# Altium project PCB_3U_Kasli.PrjPCB (part 7 of 7)
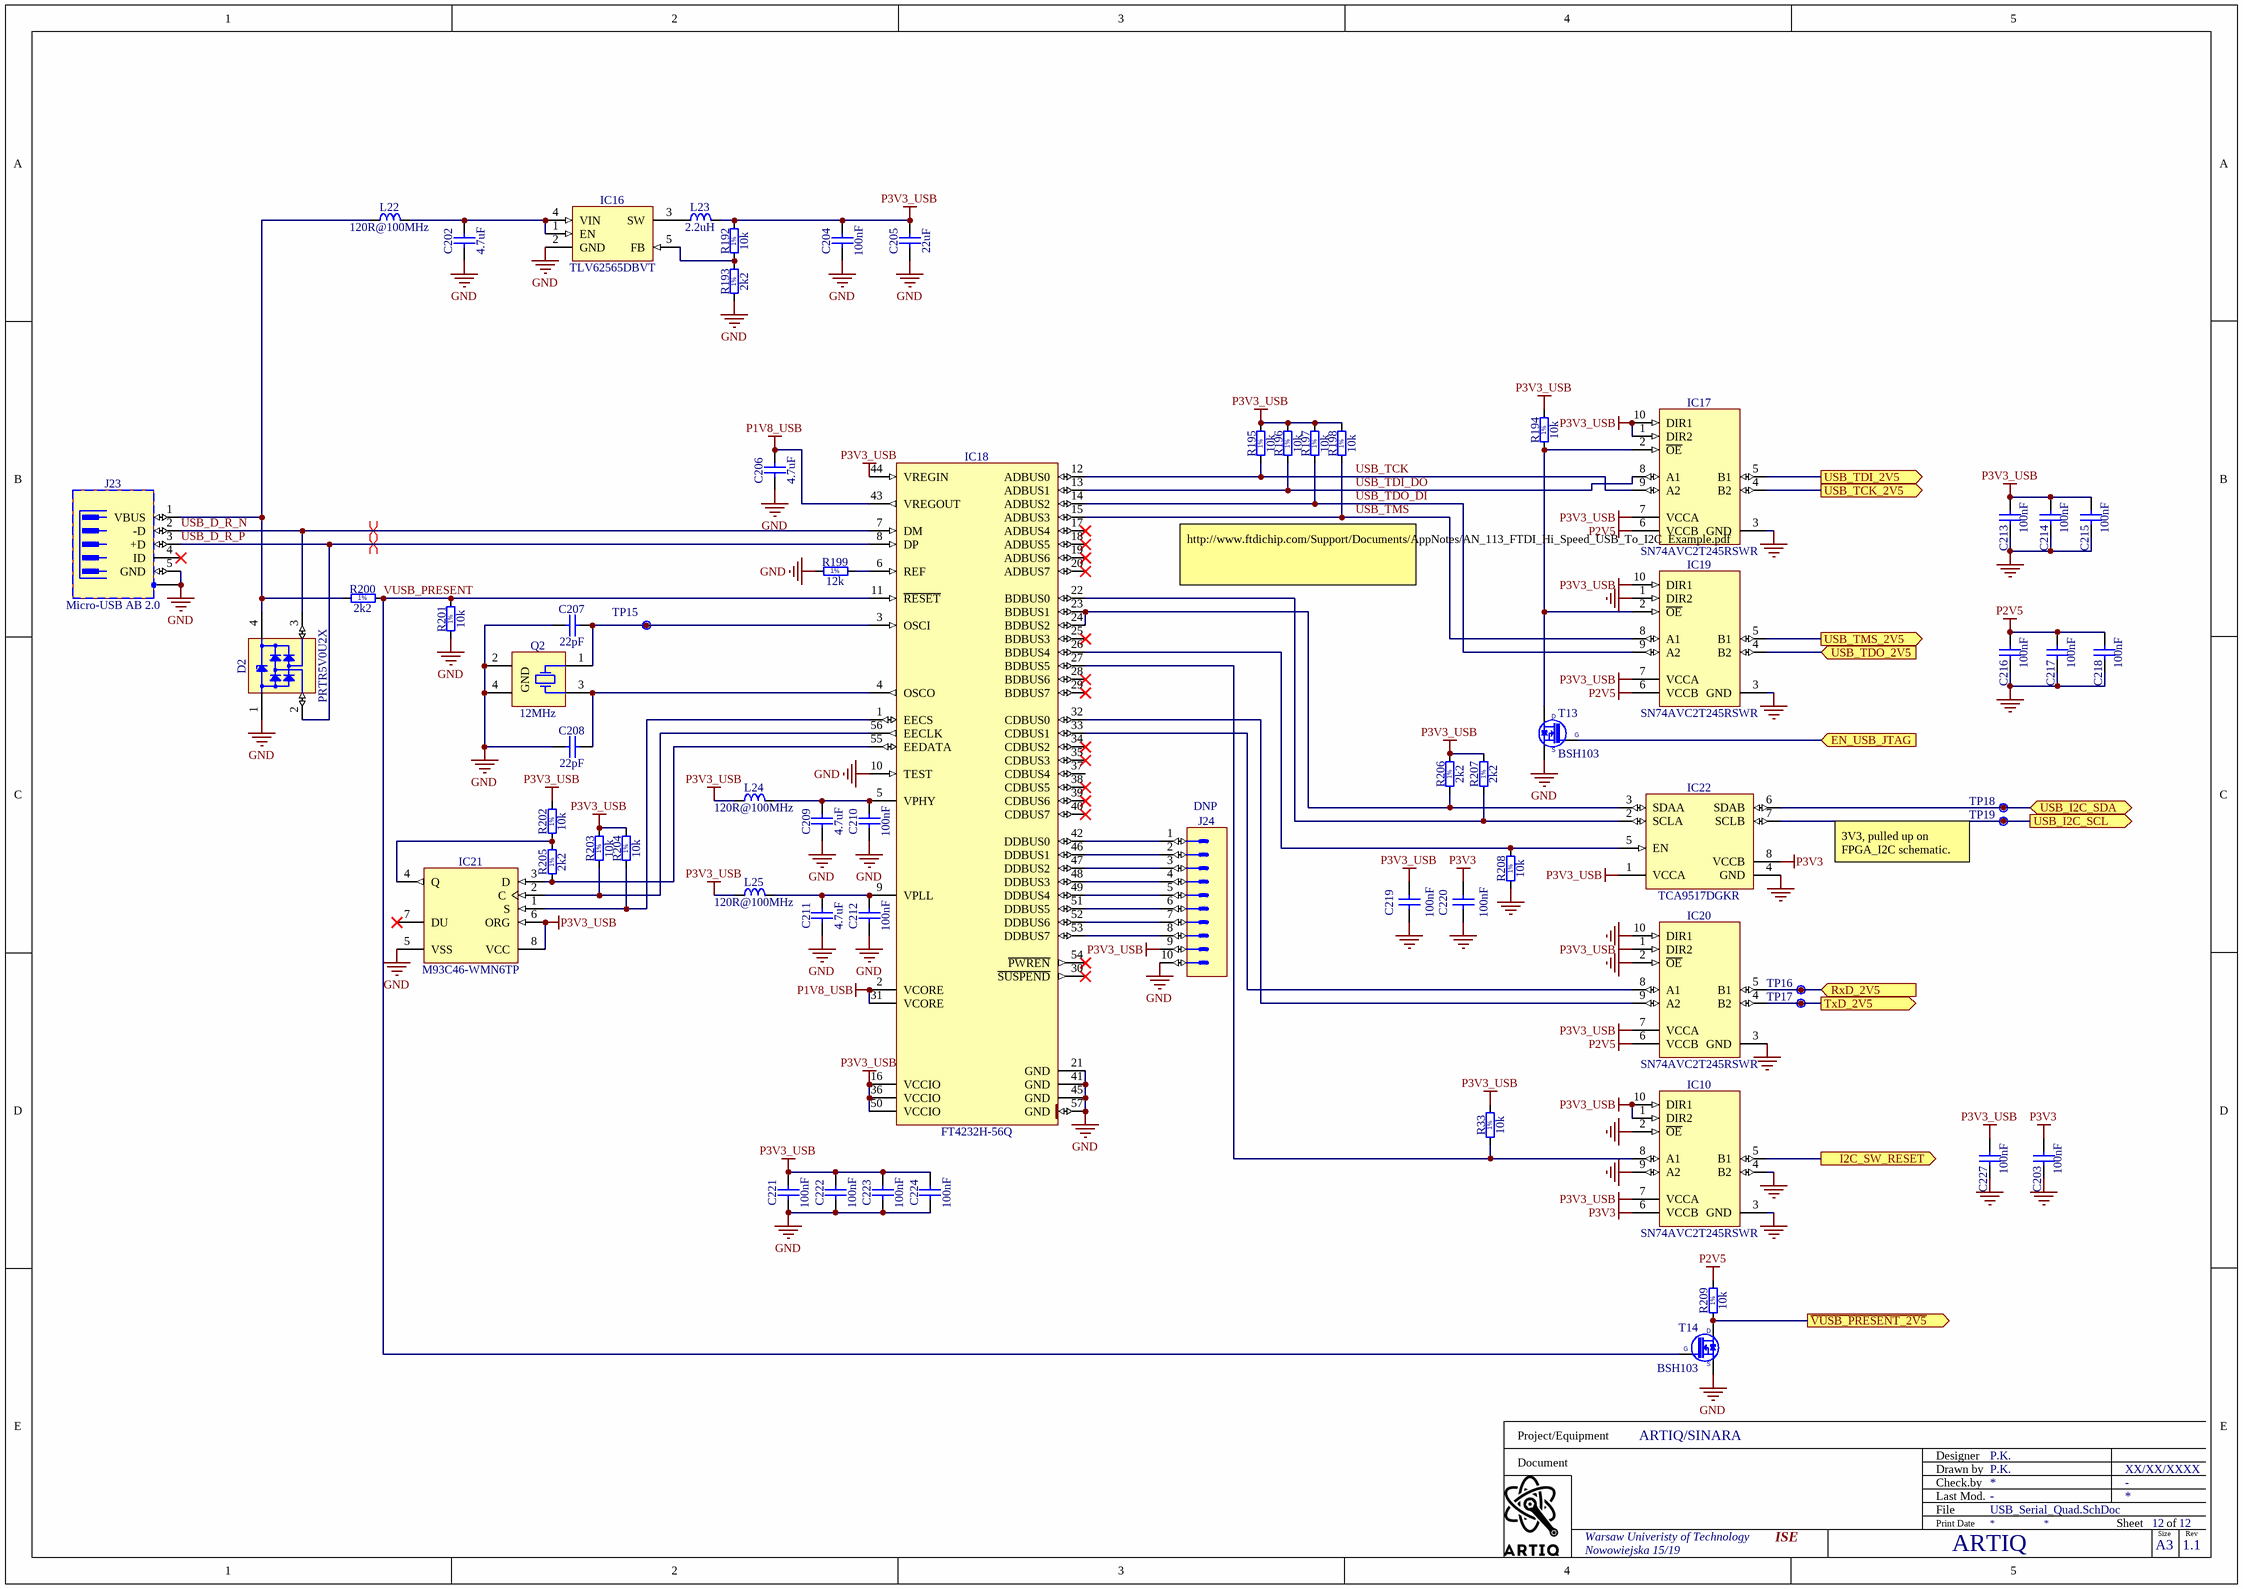
[diagram p111: USB_Serial_Quad.SchDoc]

## Nets that join several sheets
GND: TOP (6 pins), FPGA (7 pins), ClockRecovery (63 pins), PowerSupplies (110 pins), U_SFP_0 (35 pins), U_SFP_1 (35 pins), U_SFP_2 (35 pins), BackplaneConnector (25 pins), FPGAPower&Misc (176 pins), FPGAGTP (5 pins), FPGA_I2C (15 pins), FPGA_SDRAM (46 pins), IDC_EXT_Connectors (88 pins), USB_Serial_Quad (54 pins)
MGTAVCC: PowerSupplies (C148.2 L15.2), FPGAPower&Misc (10 pins)
MGTAVTT: PowerSupplies (L18.2 L19.2), FPGAPower&Misc (13 pins), FPGAGTP (R191.1)
P1V0: PowerSupplies (7 pins), FPGAPower&Misc (29 pins)
P1V5: PowerSupplies (L17.2 R61.1 T9.1 TP10.1), FPGAPower&Misc (14 pins), FPGA_SDRAM (29 pins)
P1V8: PowerSupplies (7 pins), FPGAPower&Misc (L4.1)
P2V5: TOP (5 pins), FPGA (R42.2), ClockRecovery (R1.1 R210.1), PowerSupplies (10 pins), U_SFP_0 (6 pins), U_SFP_1 (6 pins), U_SFP_2 (6 pins), FPGAPower&Misc (64 pins), FPGAGTP (C238.2 OSC2.2 OSC2.6), FPGA_I2C (5 pins), USB_Serial_Quad (7 pins)
P3V3: TOP (C161.2 U2.2), FPGA (R11.2 R20.2 R44.2), ClockRecovery (C28.2 IC7.8 L3.1), PowerSupplies (10 pins), U_SFP_0 (17 pins), U_SFP_1 (17 pins), U_SFP_2 (17 pins), BackplaneConnector (9 pins), FPGAPower&Misc (R55.2), FPGA_I2C (43 pins), FPGA_SDRAM (C172.2 IC9.7 IC9.10 R127.2), IDC_EXT_Connectors (18 pins), USB_Serial_Quad (C203.2 C220.2 IC10.6 IC22.8)
P12V0: PowerSupplies (20 pins), BackplaneConnector (6 pins), IDC_EXT_Connectors (16 pins)
VCCAUX: PowerSupplies (C233.2 L26.2), FPGAPower&Misc (13 pins)
VCCBRAM: PowerSupplies (C149.2 L13.2), FPGAPower&Misc (8 pins)
~{VUSB_PRESENT_2V5}: FPGA (IC4.N13), USB_Serial_Quad (R209.1 T14.3)
CFG_CCLK: TOP (U2.16), FPGAPower&Misc (IC4.L12)
CFG_D02: TOP (R96.1 U2.9), FPGA (IC4.P21)
CFG_D03: TOP (R94.1 U2.1), FPGA (IC4.R21)
CFG_DIN: TOP (U2.8), FPGA (IC4.R22)
CFG_FCS: TOP (R95.1 U2.7), FPGA (IC4.T19)
CFG_MOSI: TOP (U2.15), FPGA (IC4.P22)
CFG_TCK: FPGAPower&Misc (IC4.V12 J8.6), USB_Serial_Quad (IC17.4)
CFG_TDI: FPGAPower&Misc (IC4.R13 J8.10), USB_Serial_Quad (IC17.5)
CFG_TDO: FPGAPower&Misc (IC4.U13 J8.8), USB_Serial_Quad (IC19.4)
CFG_TMS: FPGAPower&Misc (IC4.T13 J8.4), USB_Serial_Quad (IC19.5)
CK_FPGAIO_N: FPGA (IC4.Y19), ClockRecovery (C6.2 R210.2 R211.2)
CK_FPGAIO_P: FPGA (IC4.Y18), ClockRecovery (C4.2 R1.2 R2.2)
CK_GTP_N: ClockRecovery (C11.2), FPGAGTP (IC4.E6)
CK_GTP_P: ClockRecovery (C8.2), FPGAGTP (IC4.F6)
CLK_EXT_N: ClockRecovery (C45.2), BackplaneConnector (J20.b3)
CLK_EXT_P: ClockRecovery (C38.2), BackplaneConnector (J20.c3)
CLKREC_N: FPGA (IC4.V20), ClockRecovery (C2.1 R3.1)
CLKREC_P: FPGA (IC4.U20), ClockRecovery (C1.1 R3.2)
EXT0.LVDS_0_N: FPGA (IC4.T4), IDC_EXT_Connectors (J9.3)
EXT0.LVDS_0_P: FPGA (IC4.R4), IDC_EXT_Connectors (J9.2)
EXT0.LVDS_1_N: FPGA (IC4.R2), IDC_EXT_Connectors (J9.6)
EXT0.LVDS_1_P: FPGA (IC4.R3), IDC_EXT_Connectors (J9.5)
EXT0.LVDS_2_N: FPGA (IC4.U1), IDC_EXT_Connectors (J9.9)
EXT0.LVDS_2_P: FPGA (IC4.T1), IDC_EXT_Connectors (J9.8)
EXT0.LVDS_3_N: FPGA (IC4.V2), IDC_EXT_Connectors (J9.12)
EXT0.LVDS_3_P: FPGA (IC4.U2), IDC_EXT_Connectors (J9.11)
EXT0.LVDS_4_N: FPGA (IC4.Y1), IDC_EXT_Connectors (J9.15)
EXT0.LVDS_4_P: FPGA (IC4.W1), IDC_EXT_Connectors (J9.14)
EXT0.LVDS_5_N: FPGA (IC4.Y2), IDC_EXT_Connectors (J9.18)
EXT0.LVDS_5_P: FPGA (IC4.W2), IDC_EXT_Connectors (J9.17)
EXT0.LVDS_6_N: FPGA (IC4.AB1), IDC_EXT_Connectors (J9.21)
EXT0.LVDS_6_P: FPGA (IC4.AA1), IDC_EXT_Connectors (J9.20)
EXT0.LVDS_7_N: FPGA (IC4.AA4), IDC_EXT_Connectors (J9.24)
EXT0.LVDS_7_P: FPGA (IC4.Y4), IDC_EXT_Connectors (J9.23)
EXT1.LVDS_0_N: FPGA (IC4.U5), IDC_EXT_Connectors (J10.3)
EXT1.LVDS_0_P: FPGA (IC4.T5), IDC_EXT_Connectors (J10.2)
EXT1.LVDS_1_N: FPGA (IC4.W7), IDC_EXT_Connectors (J10.6)
EXT1.LVDS_1_P: FPGA (IC4.V7), IDC_EXT_Connectors (J10.5)
EXT1.LVDS_2_N: FPGA (IC4.V3), IDC_EXT_Connectors (J10.9)
EXT1.LVDS_2_P: FPGA (IC4.U3), IDC_EXT_Connectors (J10.8)
EXT1.LVDS_3_N: FPGA (IC4.V8), IDC_EXT_Connectors (J10.12)
EXT1.LVDS_3_P: FPGA (IC4.V9), IDC_EXT_Connectors (J10.11)
EXT1.LVDS_4_N: FPGA (IC4.AB2), IDC_EXT_Connectors (J10.15)
EXT1.LVDS_4_P: FPGA (IC4.AB3), IDC_EXT_Connectors (J10.14)
EXT1.LVDS_5_N: FPGA (IC4.T6), IDC_EXT_Connectors (J10.18)
EXT1.LVDS_5_P: FPGA (IC4.R6), IDC_EXT_Connectors (J10.17)
EXT1.LVDS_6_N: FPGA (IC4.V5), IDC_EXT_Connectors (J10.21)
EXT1.LVDS_6_P: FPGA (IC4.U6), IDC_EXT_Connectors (J10.20)
EXT1.LVDS_7_N: FPGA (IC4.AB5), IDC_EXT_Connectors (J10.24)
EXT1.LVDS_7_P: FPGA (IC4.AA5), IDC_EXT_Connectors (J10.23)
EXT2.LVDS_0_N: FPGA (IC4.W4), IDC_EXT_Connectors (J11.3)
EXT2.LVDS_0_P: FPGA (IC4.V4), IDC_EXT_Connectors (J11.2)
EXT2.LVDS_1_N: FPGA (IC4.AA3), IDC_EXT_Connectors (J11.6)
EXT2.LVDS_1_P: FPGA (IC4.Y3), IDC_EXT_Connectors (J11.5)
EXT2.LVDS_2_N: FPGA (IC4.W5), IDC_EXT_Connectors (J11.9)
EXT2.LVDS_2_P: FPGA (IC4.W6), IDC_EXT_Connectors (J11.8)
EXT2.LVDS_3_N: FPGA (IC4.Y7), IDC_EXT_Connectors (J11.12)
EXT2.LVDS_3_P: FPGA (IC4.Y8), IDC_EXT_Connectors (J11.11)
EXT2.LVDS_4_N: FPGA (IC4.AA6), IDC_EXT_Connectors (J11.15)
EXT2.LVDS_4_P: FPGA (IC4.Y6), IDC_EXT_Connectors (J11.14)
EXT2.LVDS_5_N: FPGA (IC4.AB6), IDC_EXT_Connectors (J11.18)
EXT2.LVDS_5_P: FPGA (IC4.AB7), IDC_EXT_Connectors (J11.17)
EXT2.LVDS_6_N: FPGA (IC4.AB8), IDC_EXT_Connectors (J11.21)
EXT2.LVDS_6_P: FPGA (IC4.AA8), IDC_EXT_Connectors (J11.20)
EXT2.LVDS_7_N: FPGA (IC4.Y9), IDC_EXT_Connectors (J11.24)
EXT2.LVDS_7_P: FPGA (IC4.W9), IDC_EXT_Connectors (J11.23)
EXT3.LVDS_0_N: FPGA (IC4.L20), IDC_EXT_Connectors (J12.3)
EXT3.LVDS_0_P: FPGA (IC4.L19), IDC_EXT_Connectors (J12.2)
EXT3.LVDS_1_N: FPGA (IC4.L13), IDC_EXT_Connectors (J12.6)
EXT3.LVDS_1_P: FPGA (IC4.M13), IDC_EXT_Connectors (J12.5)
EXT3.LVDS_2_N: FPGA (IC4.M20), IDC_EXT_Connectors (J12.9)
EXT3.LVDS_2_P: FPGA (IC4.N20), IDC_EXT_Connectors (J12.8)
EXT3.LVDS_3_N: FPGA (IC4.K14), IDC_EXT_Connectors (J12.12)
EXT3.LVDS_3_P: FPGA (IC4.K13), IDC_EXT_Connectors (J12.11)
EXT3.LVDS_4_N: FPGA (IC4.L15), IDC_EXT_Connectors (J12.15)
EXT3.LVDS_4_P: FPGA (IC4.L14), IDC_EXT_Connectors (J12.14)
EXT3.LVDS_5_N: FPGA (IC4.M16), IDC_EXT_Connectors (J12.18)
EXT3.LVDS_5_P: FPGA (IC4.M15), IDC_EXT_Connectors (J12.17)
EXT3.LVDS_6_N: FPGA (IC4.L18), IDC_EXT_Connectors (J12.21)
EXT3.LVDS_6_P: FPGA (IC4.M18), IDC_EXT_Connectors (J12.20)
EXT3.LVDS_7_N: FPGA (IC4.N19), IDC_EXT_Connectors (J12.24)
EXT3.LVDS_7_P: FPGA (IC4.N18), IDC_EXT_Connectors (J12.23)
EXT4.LVDS_0_N: FPGA (IC4.V19), IDC_EXT_Connectors (J13.3)
EXT4.LVDS_0_P: FPGA (IC4.V18), IDC_EXT_Connectors (J13.2)
EXT4.LVDS_1_N: FPGA (IC4.Y22), IDC_EXT_Connectors (J13.6)
EXT4.LVDS_1_P: FPGA (IC4.Y21), IDC_EXT_Connectors (J13.5)
EXT4.LVDS_2_N: FPGA (IC4.W17), IDC_EXT_Connectors (J13.9)
EXT4.LVDS_2_P: FPGA (IC4.V17), IDC_EXT_Connectors (J13.8)
EXT4.LVDS_3_N: FPGA (IC4.W22), IDC_EXT_Connectors (J13.12)
EXT4.LVDS_3_P: FPGA (IC4.W21), IDC_EXT_Connectors (J13.11)
EXT4.LVDS_4_N: FPGA (IC4.AB18), IDC_EXT_Connectors (J13.15)
EXT4.LVDS_4_P: FPGA (IC4.AA18), IDC_EXT_Connectors (J13.14)
EXT4.LVDS_5_N: FPGA (IC4.AB20), IDC_EXT_Connectors (J13.18)
EXT4.LVDS_5_P: FPGA (IC4.AA19), IDC_EXT_Connectors (J13.17)
EXT4.LVDS_6_N: FPGA (IC4.AA21), IDC_EXT_Connectors (J13.21)
EXT4.LVDS_6_P: FPGA (IC4.AA20), IDC_EXT_Connectors (J13.20)
EXT4.LVDS_7_N: FPGA (IC4.AB22), IDC_EXT_Connectors (J13.24)
EXT4.LVDS_7_P: FPGA (IC4.AB21), IDC_EXT_Connectors (J13.23)
EXT5.LVDS_0_N: FPGA (IC4.K19), IDC_EXT_Connectors (J14.3)
EXT5.LVDS_0_P: FPGA (IC4.K18), IDC_EXT_Connectors (J14.2)
EXT5.LVDS_1_N: FPGA (IC4.H15), IDC_EXT_Connectors (J14.6)
EXT5.LVDS_1_P: FPGA (IC4.J15), IDC_EXT_Connectors (J14.5)
EXT5.LVDS_2_N: FPGA (IC4.K22), IDC_EXT_Connectors (J14.9)
EXT5.LVDS_2_P: FPGA (IC4.K21), IDC_EXT_Connectors (J14.8)
EXT5.LVDS_3_N: FPGA (IC4.M22), IDC_EXT_Connectors (J14.12)
EXT5.LVDS_3_P: FPGA (IC4.N22), IDC_EXT_Connectors (J14.11)
EXT5.LVDS_4_N: FPGA (IC4.G18), IDC_EXT_Connectors (J14.15)
EXT5.LVDS_4_P: FPGA (IC4.G17), IDC_EXT_Connectors (J14.14)
EXT5.LVDS_5_N: FPGA (IC4.J21), IDC_EXT_Connectors (J14.18)
EXT5.LVDS_5_P: FPGA (IC4.J20), IDC_EXT_Connectors (J14.17)
EXT5.LVDS_6_N: FPGA (IC4.L21), IDC_EXT_Connectors (J14.21)
EXT5.LVDS_6_P: FPGA (IC4.M21), IDC_EXT_Connectors (J14.20)
EXT5.LVDS_7_N: FPGA (IC4.K16), IDC_EXT_Connectors (J14.24)
EXT5.LVDS_7_P: FPGA (IC4.L16), IDC_EXT_Connectors (J14.23)
EXT6.LVDS_0_N: FPGA (IC4.H19), IDC_EXT_Connectors (J15.3)
EXT6.LVDS_0_P: FPGA (IC4.J19), IDC_EXT_Connectors (J15.2)
EXT6.LVDS_1_N: FPGA (IC4.H18), IDC_EXT_Connectors (J15.6)
EXT6.LVDS_1_P: FPGA (IC4.H17), IDC_EXT_Connectors (J15.5)
EXT6.LVDS_2_N: FPGA (IC4.G20), IDC_EXT_Connectors (J15.9)
EXT6.LVDS_2_P: FPGA (IC4.H20), IDC_EXT_Connectors (J15.8)
EXT6.LVDS_3_N: FPGA (IC4.J17), IDC_EXT_Connectors (J15.12)
EXT6.LVDS_3_P: FPGA (IC4.K17), IDC_EXT_Connectors (J15.11)
EXT6.LVDS_4_N: FPGA (IC4.H14), IDC_EXT_Connectors (J15.15)
EXT6.LVDS_4_P: FPGA (IC4.J14), IDC_EXT_Connectors (J15.14)
EXT6.LVDS_5_N: FPGA (IC4.H22), IDC_EXT_Connectors (J15.18)
EXT6.LVDS_5_P: FPGA (IC4.J22), IDC_EXT_Connectors (J15.17)
EXT6.LVDS_6_N: FPGA (IC4.G13), IDC_EXT_Connectors (J15.21)
EXT6.LVDS_6_P: FPGA (IC4.H13), IDC_EXT_Connectors (J15.20)
EXT6.LVDS_7_N: FPGA (IC4.G16), IDC_EXT_Connectors (J15.24)
EXT6.LVDS_7_P: FPGA (IC4.G15), IDC_EXT_Connectors (J15.23)
EXT7.LVDS_0_N: FPGA (IC4.D19), IDC_EXT_Connectors (J16.3)
EXT7.LVDS_0_P: FPGA (IC4.E19), IDC_EXT_Connectors (J16.2)
EXT7.LVDS_1_N: FPGA (IC4.G22), IDC_EXT_Connectors (J16.6)
EXT7.LVDS_1_P: FPGA (IC4.G21), IDC_EXT_Connectors (J16.5)
EXT7.LVDS_2_N: FPGA (IC4.F20), IDC_EXT_Connectors (J16.9)
EXT7.LVDS_2_P: FPGA (IC4.F19), IDC_EXT_Connectors (J16.8)
EXT7.LVDS_3_N: FPGA (IC4.F14), IDC_EXT_Connectors (J16.12)
EXT7.LVDS_3_P: FPGA (IC4.F13), IDC_EXT_Connectors (J16.11)
EXT7.LVDS_4_N: FPGA (IC4.E14), IDC_EXT_Connectors (J16.15)
EXT7.LVDS_4_P: FPGA (IC4.E13), IDC_EXT_Connectors (J16.14)
EXT7.LVDS_5_N: FPGA (IC4.D15), IDC_EXT_Connectors (J16.18)
EXT7.LVDS_5_P: FPGA (IC4.D14), IDC_EXT_Connectors (J16.17)
EXT7.LVDS_6_N: FPGA (IC4.E18), IDC_EXT_Connectors (J16.21)
EXT7.LVDS_6_P: FPGA (IC4.F18), IDC_EXT_Connectors (J16.20)
EXT7.LVDS_7_N: FPGA (IC4.E17), IDC_EXT_Connectors (J16.24)
EXT7.LVDS_7_P: FPGA (IC4.F16), IDC_EXT_Connectors (J16.23)
EXT8.LVDS_0_N: FPGA (IC4.C17), BackplaneConnector (J20.a6)
EXT8.LVDS_0_P: FPGA (IC4.D17), BackplaneConnector (J20.a5)
EXT8.LVDS_1_N: FPGA (IC4.A16), BackplaneConnector (J20.b6)
EXT8.LVDS_1_P: FPGA (IC4.A15), BackplaneConnector (J20.b5)
EXT8.LVDS_2_N: FPGA (IC4.A14), BackplaneConnector (J20.c6)
EXT8.LVDS_2_P: FPGA (IC4.A13), BackplaneConnector (J20.c5)
EXT8.LVDS_3_N: FPGA (IC4.A19), BackplaneConnector (J20.a8)
EXT8.LVDS_3_P: FPGA (IC4.A18), BackplaneConnector (J20.a7)
EXT8.LVDS_4_N: FPGA (IC4.B13), BackplaneConnector (J20.b8)
EXT8.LVDS_4_P: FPGA (IC4.C13), BackplaneConnector (J20.b7)
EXT8.LVDS_5_N: FPGA (IC4.C15), BackplaneConnector (J20.c8)
EXT8.LVDS_5_P: FPGA (IC4.C14), BackplaneConnector (J20.c7)
EXT8.LVDS_6_N: FPGA (IC4.A20), BackplaneConnector (J20.a10)
EXT8.LVDS_6_P: FPGA (IC4.B20), BackplaneConnector (J20.a9)
EXT8.LVDS_7_N: FPGA (IC4.B16), BackplaneConnector (J20.b10)
EXT8.LVDS_7_P: FPGA (IC4.B15), BackplaneConnector (J20.b9)
EXT9.LVDS_0_N: FPGA (IC4.C19), BackplaneConnector (J20.a13)
EXT9.LVDS_0_P: FPGA (IC4.C18), BackplaneConnector (J20.a12)
EXT9.LVDS_1_N: FPGA (IC4.A21), BackplaneConnector (J20.b13)
EXT9.LVDS_1_P: FPGA (IC4.B21), BackplaneConnector (J20.b12)
EXT9.LVDS_2_N: FPGA (IC4.D16), BackplaneConnector (J20.c13)
EXT9.LVDS_2_P: FPGA (IC4.E16), BackplaneConnector (J20.c12)
EXT9.LVDS_3_N: FPGA (IC4.B18), BackplaneConnector (J20.a15)
EXT9.LVDS_3_P: FPGA (IC4.B17), BackplaneConnector (J20.a14)
EXT9.LVDS_4_N: FPGA (IC4.C20), BackplaneConnector (J20.b15)
EXT9.LVDS_4_P: FPGA (IC4.D20), BackplaneConnector (J20.b14)
EXT9.LVDS_5_N: FPGA (IC4.D22), BackplaneConnector (J20.c15)
EXT9.LVDS_5_P: FPGA (IC4.E22), BackplaneConnector (J20.c14)
EXT9.LVDS_6_N: FPGA (IC4.B22), BackplaneConnector (J20.a17)
EXT9.LVDS_6_P: FPGA (IC4.C22), BackplaneConnector (J20.a16)
EXT9.LVDS_7_N: FPGA (IC4.D21), BackplaneConnector (J20.b17)
EXT9.LVDS_7_P: FPGA (IC4.E21), BackplaneConnector (J20.b16)
EXT10.LVDS_0_N: FPGA (IC4.V14), BackplaneConnector (J20.a20)
EXT10.LVDS_0_P: FPGA (IC4.V13), BackplaneConnector (J20.a19)
EXT10.LVDS_1_N: FPGA (IC4.AA16), BackplaneConnector (J20.b20)
EXT10.LVDS_1_P: FPGA (IC4.Y16), BackplaneConnector (J20.b19)
EXT10.LVDS_2_N: FPGA (IC4.AB17), BackplaneConnector (J20.c20)
EXT10.LVDS_2_P: FPGA (IC4.AB16), BackplaneConnector (J20.c19)
EXT10.LVDS_3_N: FPGA (IC4.AB13), BackplaneConnector (J20.a22)
EXT10.LVDS_3_P: FPGA (IC4.AA13), BackplaneConnector (J20.a21)
EXT10.LVDS_4_N: FPGA (IC4.AA14), BackplaneConnector (J20.b22)
EXT10.LVDS_4_P: FPGA (IC4.Y13), BackplaneConnector (J20.b21)
EXT10.LVDS_5_N: FPGA (IC4.AB15), BackplaneConnector (J20.c22)
EXT10.LVDS_5_P: FPGA (IC4.AA15), BackplaneConnector (J20.c21)
EXT10.LVDS_6_N: FPGA (IC4.W16), BackplaneConnector (J20.a24)
EXT10.LVDS_6_P: FPGA (IC4.W15), BackplaneConnector (J20.a23)
EXT10.LVDS_7_N: FPGA (IC4.T15), BackplaneConnector (J20.b24)
EXT10.LVDS_7_P: FPGA (IC4.T14), BackplaneConnector (J20.b23)
EXT11.LVDS_0_N: FPGA (IC4.W12), BackplaneConnector (J20.a27)
EXT11.LVDS_0_P: FPGA (IC4.W11), BackplaneConnector (J20.a26)
EXT11.LVDS_1_N: FPGA (IC4.V15), BackplaneConnector (J20.b27)
EXT11.LVDS_1_P: FPGA (IC4.U15), BackplaneConnector (J20.b26)
EXT11.LVDS_2_N: FPGA (IC4.Y14), BackplaneConnector (J20.c27)
EXT11.LVDS_2_P: FPGA (IC4.W14), BackplaneConnector (J20.c26)
EXT11.LVDS_3_N: FPGA (IC4.W10), BackplaneConnector (J20.a29)
EXT11.LVDS_3_P: FPGA (IC4.V10), BackplaneConnector (J20.a28)
EXT11.LVDS_4_N: FPGA (IC4.Y12), BackplaneConnector (J20.b29)
EXT11.LVDS_4_P: FPGA (IC4.Y11), BackplaneConnector (J20.b28)
EXT11.LVDS_5_N: FPGA (IC4.AB12), BackplaneConnector (J20.c29)
EXT11.LVDS_5_P: FPGA (IC4.AB11), BackplaneConnector (J20.c28)
EXT11.LVDS_6_N: FPGA (IC4.AA11), BackplaneConnector (J20.a31)
EXT11.LVDS_6_P: FPGA (IC4.AA10), BackplaneConnector (J20.a30)
EXT11.LVDS_7_N: FPGA (IC4.AB10), BackplaneConnector (J20.b31)
EXT11.LVDS_7_P: FPGA (IC4.AA9), BackplaneConnector (J20.b30)
I2C_3V3_SCL: FPGA_I2C (IC13.7 IC14.19 IC15.19 R149.1), USB_Serial_Quad (IC22.7 TP19.1)
I2C_3V3_SDA: FPGA_I2C (IC13.6 IC14.20 IC15.20 R148.1), USB_Serial_Quad (IC22.6 TP18.1)
I2C_SCL_0: FPGA_I2C (IC14.17 R156.1), IDC_EXT_Connectors (D3.3 J9.27)
I2C_SCL_1: FPGA_I2C (IC14.13 R158.1), IDC_EXT_Connectors (D4.3 J10.27)
I2C_SCL_2: FPGA_I2C (IC14.11 R160.1), IDC_EXT_Connectors (D5.3 J11.27)
I2C_SCL_3: FPGA_I2C (IC14.8 R162.1), IDC_EXT_Connectors (D6.3 J12.27)
I2C_SCL_4: FPGA_I2C (IC14.6 R164.1), IDC_EXT_Connectors (D7.3 J13.27)
I2C_SCL_5: FPGA_I2C (IC14.4 R166.1), IDC_EXT_Connectors (D8.3 J14.27)
I2C_SCL_6: FPGA_I2C (IC14.2 R168.1), IDC_EXT_Connectors (D9.3 J15.27)
I2C_SCL_7: FPGA_I2C (IC14.15 R170.1), IDC_EXT_Connectors (D10.3 J16.27)
I2C_SCL_8: BackplaneConnector (D11.3 J20.c10), FPGA_I2C (IC15.11 R172.1)
I2C_SCL_9: BackplaneConnector (D13.3 J20.c17), FPGA_I2C (IC15.13 R175.1)
I2C_SCL_10: BackplaneConnector (D12.3 J20.c24), FPGA_I2C (IC15.17 R178.1)
I2C_SCL_11: BackplaneConnector (D14.3 J20.c31), FPGA_I2C (IC15.15 R182.1)
I2C_SDA_0: FPGA_I2C (IC14.16 R155.1), IDC_EXT_Connectors (D3.2 J9.26)
I2C_SDA_1: FPGA_I2C (IC14.12 R157.1), IDC_EXT_Connectors (D4.2 J10.26)
I2C_SDA_2: FPGA_I2C (IC14.10 R159.1), IDC_EXT_Connectors (D5.2 J11.26)
I2C_SDA_3: FPGA_I2C (IC14.7 R161.1), IDC_EXT_Connectors (D6.2 J12.26)
I2C_SDA_4: FPGA_I2C (IC14.5 R163.1), IDC_EXT_Connectors (D7.2 J13.26)
I2C_SDA_5: FPGA_I2C (IC14.3 R165.1), IDC_EXT_Connectors (D8.2 J14.26)
I2C_SDA_6: FPGA_I2C (IC14.1 R167.1), IDC_EXT_Connectors (D9.2 J15.26)
I2C_SDA_7: FPGA_I2C (IC14.14 R169.1), IDC_EXT_Connectors (D10.2 J16.26)
I2C_SDA_8: BackplaneConnector (D11.2 J20.c9), FPGA_I2C (IC15.10 R171.1)
I2C_SDA_9: BackplaneConnector (D13.2 J20.c16), FPGA_I2C (IC15.12 R173.1)
I2C_SDA_10: BackplaneConnector (D12.2 J20.c23), FPGA_I2C (IC15.16 R176.1)
I2C_SDA_11: BackplaneConnector (D14.2 J20.c30), FPGA_I2C (IC15.14 R180.1)
I2C_SW_RESET: FPGA_I2C (IC14.24 IC15.24 R151.1), USB_Serial_Quad (IC10.5)
I2C_SW_SCL: FPGA (IC4.J16), FPGA_I2C (IC13.2 R147.1 TP14.1)
I2C_SW_SDA: FPGA (IC4.F15), FPGA_I2C (IC13.3 R146.1 TP13.1)
NetC53_2: FPGAPower&Misc (C53.2 J8.13 R58.1), USB_Serial_Quad (T13.1)
NetC228_1: TOP (J18.1), ClockRecovery (C228.1)
RESETn: PowerSupplies (IC6.20 R51.1 T6.1 TP5.1), FPGAPower&Misc (R53.1)
RxD_2V5: FPGA (IC4.T16), USB_Serial_Quad (IC20.5 TP16.1)
SFP_0.SCL: U_SFP_0 (J21A.5), FPGA_I2C (IC15.2 R184.1)
SFP_0.SDA: U_SFP_0 (J21A.4), FPGA_I2C (IC15.1 R183.1)
SFP_1.SCL: U_SFP_1 (J21B.5), FPGA_I2C (IC15.4 R186.1)
SFP_1.SDA: U_SFP_1 (J21B.4), FPGA_I2C (IC15.3 R185.1)
SFP_2.SCL: U_SFP_2 (J21C.5), FPGA_I2C (IC15.6 R188.1)
SFP_2.SDA: U_SFP_2 (J21C.4), FPGA_I2C (IC15.5 R187.1)
SFP_RX_TX_0.RD_N: U_SFP_0 (J21A.12), FPGAGTP (IC4.A8)
SFP_RX_TX_0.RD_P: U_SFP_0 (J21A.13), FPGAGTP (IC4.B8)
SFP_RX_TX_0.TD_N: U_SFP_0 (J21A.19), FPGAGTP (IC4.A4)
SFP_RX_TX_0.TD_P: U_SFP_0 (J21A.18), FPGAGTP (IC4.B4)
SFP_RX_TX_1.RD_N: U_SFP_1 (J21B.12), FPGAGTP (IC4.C11)
SFP_RX_TX_1.RD_P: U_SFP_1 (J21B.13), FPGAGTP (IC4.D11)
SFP_RX_TX_1.TD_N: U_SFP_1 (J21B.19), FPGAGTP (IC4.C5)
SFP_RX_TX_1.TD_P: U_SFP_1 (J21B.18), FPGAGTP (IC4.D5)
SFP_RX_TX_2.RD_N: U_SFP_2 (J21C.12), FPGAGTP (IC4.A10)
SFP_RX_TX_2.RD_P: U_SFP_2 (J21C.13), FPGAGTP (IC4.B10)
SFP_RX_TX_2.TD_N: U_SFP_2 (J21C.19), FPGAGTP (IC4.A6)
SFP_RX_TX_2.TD_P: U_SFP_2 (J21C.18), FPGAGTP (IC4.B6)
Si5324_SCL: ClockRecovery (IC7.7), FPGA_I2C (IC5.1 IC15.8 R190.1)
Si5324_SDA: ClockRecovery (IC7.6), FPGA_I2C (IC5.3 IC15.7 R189.1)
TxD_2V5: FPGA (IC4.M17), USB_Serial_Quad (IC20.4 TP17.1)

## Assembly variants
standard: not fitted C9 C13 C159 C160 J24 L19 R43 TR1 TR1 U1; alternate parts R9 -> R0402_51R_1%_0.0625W_100PPM
with_baluns: not fitted C9 C13 C159 C160 J24 L19 R5 R13 R43 R80 U1